# EAGLE schematic MCP3002 (EAGLE 9.1.2)
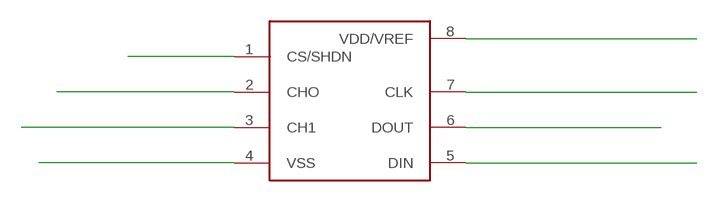
[diagram p0: schematic, sheet 1]

## Parts
DPI1  DIP762W53P254L900H508Q8B'  [SOP254P1132X265-8N]

## Nets
N$1 [Power]: DPI1.8(VDD/VREF)
N$2: DPI1.7(CLK)
N$3: DPI1.6(DOUT)
N$4: DPI1.5(DIN)
N$5 [Power]: DPI1.4(VSS)
N$6: DPI1.3(CH1)
N$7: DPI1.2(CHO)
N$8: DPI1.1(CS/SHDN)

## Library data of the parts
DPI1 = GHII MCP 3002:DIP762W53P254L900H508Q8B

## Net classes
0 default: width 0.762 mm, drill 0.762 mm, clearance 0.635 mm
1 Power: width 1 mm, drill 1 mm, clearance 0.635 mm